# Altium project C5402AudioSystem.PrjPCB
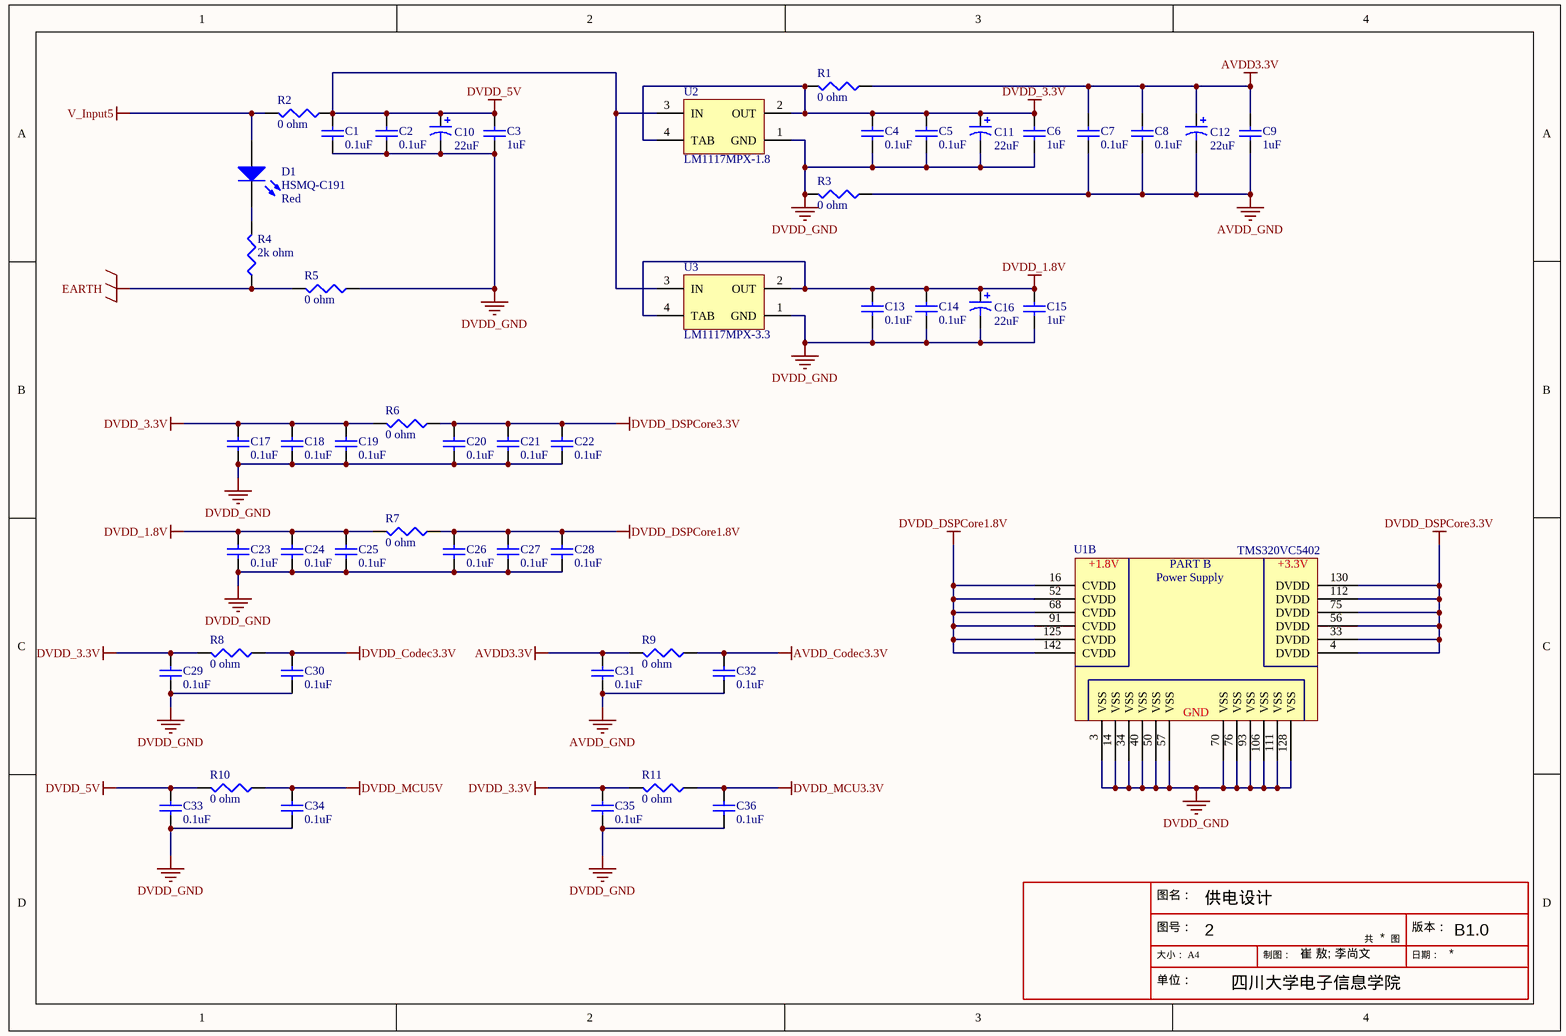
[diagram p0: PART2_PowerSupply.SchDoc]
1 sheet, 51 parts. Net scope: global (net labels, ports and power ports of the same name join across sheets).
Board file: PCB Layout.PcbDoc

## Sheet PART2_PowerSupply.SchDoc: 供电设计
size A4; Author: 崔 敖; 李尚文; Revision: B1.0; SheetNumber: 2

### Parts
C1  value 0.1uF  [1608[0603]]  (hidden comment: Cap Semi)
C2  value 0.1uF  [1608[0603]]  (hidden comment: Cap Semi)
C3  value 1uF  [1608[0603]]  (hidden comment: Cap Semi)
C4  value 0.1uF  [1608[0603]]  (hidden comment: Cap Semi)
C5  value 0.1uF  [1608[0603]]  (hidden comment: Cap Semi)
C6  value 1uF  [1608[0603]]  (hidden comment: Cap Semi)
C7  value 0.1uF  [1608[0603]]  (hidden comment: Cap Semi)
C8  value 0.1uF  [1608[0603]]  (hidden comment: Cap Semi)
C9  value 1uF  [1608[0603]]  (hidden comment: Cap Semi)
C10  value 22uF  [C0805]  (hidden comment: Cap Tan)
C11  value 22uF  [C0805]  (hidden comment: Cap Tan)
C12  value 22uF  [C0805]  (hidden comment: Cap Tan)
C13  value 0.1uF  [1608[0603]]  (hidden comment: Cap Semi)
C14  value 0.1uF  [1608[0603]]  (hidden comment: Cap Semi)
C15  value 1uF  [1608[0603]]  (hidden comment: Cap Semi)
C16  value 22uF  [C0805]  (hidden comment: Cap Tan)
C17  value 0.1uF  [1608[0603]]  (hidden comment: Cap Semi)
C18  value 0.1uF  [1608[0603]]  (hidden comment: Cap Semi)
C19  value 0.1uF  [1608[0603]]  (hidden comment: Cap Semi)
C20  value 0.1uF  [1608[0603]]  (hidden comment: Cap Semi)
C21  value 0.1uF  [1608[0603]]  (hidden comment: Cap Semi)
C22  value 0.1uF  [1608[0603]]  (hidden comment: Cap Semi)
C23  value 0.1uF  [1608[0603]]  (hidden comment: Cap Semi)
C24  value 0.1uF  [1608[0603]]  (hidden comment: Cap Semi)
C25  value 0.1uF  [1608[0603]]  (hidden comment: Cap Semi)
C26  value 0.1uF  [1608[0603]]  (hidden comment: Cap Semi)
C27  value 0.1uF  [1608[0603]]  (hidden comment: Cap Semi)
C28  value 0.1uF  [1608[0603]]  (hidden comment: Cap Semi)
C29  value 0.1uF  [1608[0603]]  (hidden comment: Cap Semi)
C30  value 0.1uF  [1608[0603]]  (hidden comment: Cap Semi)
C31  value 0.1uF  [1608[0603]]  (hidden comment: Cap Semi)
C32  value 0.1uF  [1608[0603]]  (hidden comment: Cap Semi)
C33  value 0.1uF  [1608[0603]]  (hidden comment: Cap Semi)
C34  value 0.1uF  [1608[0603]]  (hidden comment: Cap Semi)
C35  value 0.1uF  [1608[0603]]  (hidden comment: Cap Semi)
C36  value 0.1uF  [1608[0603]]  (hidden comment: Cap Semi)
D1  HSMQ-C191  LED_Colour: Red  [1.6X0.8X0.6]
R1  value 0 ohm  [J1-0603]  (hidden comment: Res3)
R2  value 0 ohm  [J1-0603]  (hidden comment: Res3)
R3  value 0 ohm  [J1-0603]  (hidden comment: Res3)
R4  value 2k ohm  [J1-0603]  (hidden comment: Res3)
R5  value 0 ohm  [J1-0603]  (hidden comment: Res3)
R6  value 0 ohm  [J1-0603]  (hidden comment: Res3)
R7  value 0 ohm  [J1-0603]  (hidden comment: Res3)
R8  value 0 ohm  [J1-0603]  (hidden comment: Res3)
R9  value 0 ohm  [J1-0603]  (hidden comment: Res3)
R10  value 0 ohm  [J1-0603]  (hidden comment: Res3)
R11  value 0 ohm  [J1-0603]  (hidden comment: Res3)
U1  TMS320VC5402  [TMS320VC5401_PQFP144]  (part B of 5)
U2  LM1117MPX-1.8  [MP04A_N]
U3  LM1117MPX-3.3  [MP04A_N]

### Nets
AVDD3.3V: C7.1 C8.1 C9.1 C12.1 C31.1 R1.1 R9.2
AVDD_Codec3.3V: C32.1 R9.1
AVDD_GND: C7.2 C8.2 C9.2 C12.2 C31.2 C32.2 R3.1
DVDD_1.8V: C13.1 C14.1 C15.1 C16.1 C23.1 C24.1 C25.1 R7.2 U3.2(OUT) U3.4(TAB)
DVDD_3.3V: C4.1 C5.1 C6.1 C11.1 C17.1 C18.1 C19.1 C29.1 C35.1 R1.2 R6.2 R8.2 R11.2 U2.2(OUT) U2.4(TAB)
DVDD_5V: C1.1 C2.1 C3.1 C10.1 C33.1 R2.1 R10.2 U2.3(IN) U3.3(IN)
DVDD_Codec3.3V: C30.1 R8.1
DVDD_DSPCore1.8V: C26.1 C27.1 C28.1 R7.1 U1.16(CVDD) U1.52(CVDD) U1.68(CVDD) U1.91(CVDD) U1.125(CVDD) U1.142(CVDD)
DVDD_DSPCore3.3V: C20.1 C21.1 C22.1 R6.1 U1.4(DVDD) U1.33(DVDD) U1.56(DVDD) U1.75(DVDD) U1.112(DVDD) U1.130(DVDD)
DVDD_GND: C1.2 C2.2 C3.2 C4.2 C5.2 C6.2 C10.2 C11.2 C13.2 C14.2 C15.2 C16.2 C17.2 C18.2 C19.2 C20.2 C21.2 C22.2 C23.2 C24.2 C25.2 C26.2 C27.2 C28.2 C29.2 C30.2 C33.2 C34.2 C35.2 C36.2 R3.2 R5.1 U1.3(VSS) U1.14(VSS) U1.34(VSS) U1.40(VSS) U1.50(VSS) U1.57(VSS) U1.70(VSS) U1.76(VSS) U1.93(VSS) U1.106(VSS) U1.111(VSS) U1.128(VSS) U2.1(GND) U3.1(GND)
DVDD_MCU3.3V: C36.1 R11.1
DVDD_MCU5V: C34.1 R10.1
EARTH: R4.1 R5.2
V_Input5: D1.1(A) R2.2
NetD1_2: D1.2(K) R4.2

### Notes on the sheet
- 图名：
- 图号：
- 大小： A4
- 单位：
- 四川大学电子信息学院
- 制图：
- 共
- 图
- 版本：
- 日期：
- (in symbol TMS320VC5402, part B) +1.8V; PART B; +3.3V; Power Supply; GND

### Library data of the parts
C1-C9 C13-C15 C17-C36 = Cap Semi: 贴片电容 1608; Published: 8-Jun-2000; LatestRevisionDate: 29-May-2009; LatestRevisionNote: IPC-7351 Footprint Added.; PackageReference: C1206; Publisher: Altium Limited; PackageDescription: Chip Capacitor
C10-C12 C16 = Cap Pol3: 贴片钽电容 C0805; Published: 8-Jun-2000; LatestRevisionDate: 29-May-2009; LatestRevisionNote: IPC-7351 Footprint Added.; PackageReference: C0805; Publisher: Altium Limited; PackageDescription: Chip Capacitor
D1 = HSMQ-C191: Top Mount Low Profile Chip LED, Green; LuminousIntensity: 40mcd (Minimum).; PCB_Layout: Complies with manufacturer's recommendation.; Published: 11-Dec-2002; DatasheetDocument: 6-Apr-2002; PackageDocument: 11-Mar-2002; PackageReference: 1.6X0.8X0.6; Publisher: Altium Limited; ComponentLink1Description: Manufacturer Link; ComponentLink1URL: http://www.agilent.com/; ComponentLink2Description: Datasheet; ComponentLink2URL: http://cp.literature.agilent.com/litweb/pdf/5988-4832EN.pdf
R1-R11 = Res3: 贴片电阻 0603; Published: 8-Jun-2000; LatestRevisionDate: 29-May-2009; LatestRevisionNote: IPC-7351 Footprint Added.; PackageReference: J1-0603; Publisher: Altium Limited; PackageDescription: Chip Resistor
U2 = LM1117MPX-1.8: 800mA Low-Dropout Linear Regulator, 4-pin SOT-223; Manufacturer: National Semiconductor; PackageTopMarking: XYTT*N12A; PowerWise: N; CompType: LDO IC; Published: 1-Mar-2010; DatasheetVersion: Apr-2006; PackageVersion: revB, Apr-2003; PackageReference: MP04A; Publisher: Altium Limited; PackageDescription: Molded SOT-223, 6.50 x 3.56 x 1.6mm Body, 4 Lead, 2.3mm Pitch; Supplier 1: Farnell; Supplier Part Number 1: 1652311; PartNumber: LM1117MPX-1.8; RoHS: N; PinCount: 4; Code_JEDEC: TO-261-AA; Code_IPC: SOT223-4; ComponentLink1Description: LM1117 Datasheet; ComponentLink1URL: http://www.national.com/ds/LM/LM1117.pdf; ComponentLink2Description: LM1117 Web Page; ComponentLink2URL: http://www.national.com/pf/LM/LM1117.html; ComponentLink3Description: MP04A Package Page; ComponentLink3URL: http://www.national.com/packaging/folders/mp04a.html
U3 = LM1117MPX-3.3: 800mA Low-Dropout Linear Regulator, 4-pin SOT-223; Manufacturer: National Semiconductor; PackageTopMarking: XYTT*N05A; PowerWise: N; CompType: LDO IC; Published: 1-Mar-2010; DatasheetVersion: Apr-2006; PackageVersion: revB, Apr-2003; PackageReference: MP04A; Publisher: Altium Limited; PackageDescription: Molded SOT-223, 6.50 x 3.56 x 1.6mm Body, 4 Lead, 2.3mm Pitch; Supplier 1: Farnell; Supplier Part Number 1: 1652313; PartNumber: LM1117MPX-3.3; RoHS: N; PinCount: 4; Code_JEDEC: TO-261-AA; Code_IPC: SOT223-4; ComponentLink1Description: LM1117 Datasheet; ComponentLink1URL: http://www.national.com/ds/LM/LM1117.pdf; ComponentLink2Description: LM1117 Web Page; ComponentLink2URL: http://www.national.com/pf/LM/LM1117.html; ComponentLink3Description: MP04A Package Page; ComponentLink3URL: http://www.national.com/packaging/folders/mp04a.html